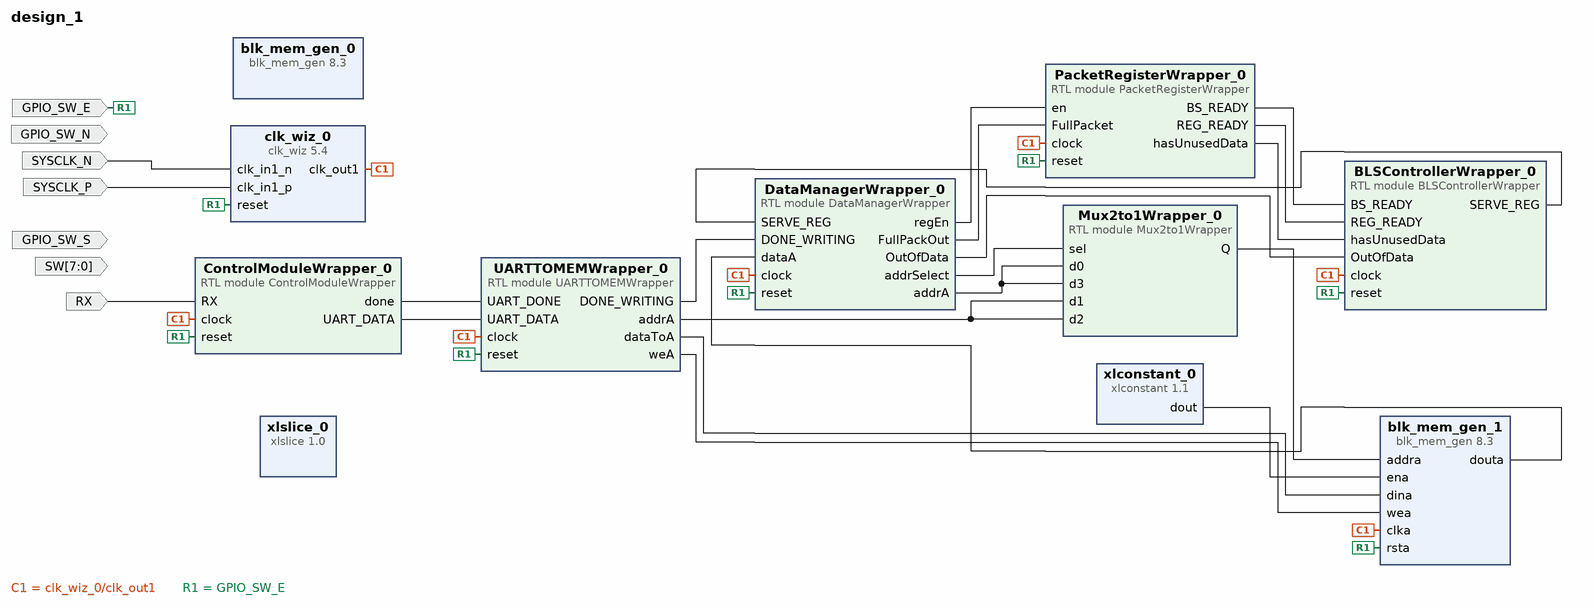
[diagram p0: block diagram of the top level]
# Vivado block design design_1, xc7vx485tffg1761-2, Vivado 2017.2
create_bd_design design_1

create_bd_port -dir I -type clk SYSCLK_N
create_bd_port -dir I -type clk SYSCLK_P
create_bd_port -dir I GPIO_SW_S
create_bd_port -dir I -type rst GPIO_SW_E
set_property -dict {CONFIG.POLARITY ACTIVE_HIGH} [get_bd_ports GPIO_SW_E]
create_bd_port -dir I GPIO_SW_N
create_bd_port -dir I -from 7 -to 0 SW
create_bd_port -dir I RX

create_bd_cell -type ip -vlnv xilinx.com:ip:clk_wiz:5.4 clk_wiz_0
set_property -dict [list \
  CONFIG.CLKIN1_JITTER_PS 50.0 \
  CONFIG.CLKOUT1_REQUESTED_OUT_FREQ 100 \
  CONFIG.PRIM_SOURCE Differential_clock_capable_pin \
  CONFIG.MMCM_DIVCLK_DIVIDE 1 \
  CONFIG.MMCM_CLKFBOUT_MULT_F 5.000 \
  CONFIG.MMCM_CLKIN1_PERIOD 5.000 \
  CONFIG.MMCM_CLKIN2_PERIOD 10.0 \
  CONFIG.MMCM_CLKOUT0_DIVIDE_F 10.000 \
  CONFIG.USE_BOARD_FLOW true \
  CONFIG.CLK_IN1_BOARD_INTERFACE sys_diff_clock \
  CONFIG.RESET_BOARD_INTERFACE Custom \
  CONFIG.CLKOUT1_JITTER 112.316 \
  CONFIG.CLKOUT1_PHASE_ERROR 89.971 \
] [get_bd_cells clk_wiz_0]
create_bd_cell -type ip -vlnv xilinx.com:ip:xlslice:1.0 xlslice_0
set_property -dict {CONFIG.DIN_FROM 7 CONFIG.DOUT_WIDTH 8} [get_bd_cells xlslice_0]
create_bd_cell -type ip -vlnv xilinx.com:ip:blk_mem_gen:8.3 blk_mem_gen_0
set_property -dict [list \
  CONFIG.Memory_Type True_Dual_Port_RAM \
  CONFIG.Assume_Synchronous_Clk true \
  CONFIG.Enable_B Use_ENB_Pin \
  CONFIG.Use_RSTB_Pin true \
  CONFIG.Port_B_Clock 100 \
  CONFIG.Port_B_Write_Rate 50 \
  CONFIG.Port_B_Enable_Rate 100 \
] [get_bd_cells blk_mem_gen_0]
create_bd_cell -type module -reference ControlModuleWrapper ControlModuleWrapper_0
create_bd_cell -type ip -vlnv xilinx.com:ip:blk_mem_gen:8.3 blk_mem_gen_1
set_property -dict [list \
  CONFIG.Memory_Type True_Dual_Port_RAM \
  CONFIG.Assume_Synchronous_Clk true \
  CONFIG.Enable_B Use_ENB_Pin \
  CONFIG.Use_RSTB_Pin true \
  CONFIG.Port_B_Clock 100 \
  CONFIG.Port_B_Write_Rate 50 \
  CONFIG.Port_B_Enable_Rate 100 \
] [get_bd_cells blk_mem_gen_1]
create_bd_cell -type module -reference UARTTOMEMWrapper UARTTOMEMWrapper_0
create_bd_cell -type module -reference DataManagerWrapper DataManagerWrapper_0
create_bd_cell -type module -reference PacketRegisterWrapper PacketRegisterWrapper_0
create_bd_cell -type module -reference BLSControllerWrapper BLSControllerWrapper_0
create_bd_cell -type module -reference Mux2to1Wrapper Mux2to1Wrapper_0
set_property -dict {CONFIG.WIDTH 32} [get_bd_cells Mux2to1Wrapper_0]
create_bd_cell -type ip -vlnv xilinx.com:ip:xlconstant:1.1 xlconstant_0

# ---- connections ----

connect_bd_net -net clk_in1_n_1 [get_bd_ports SYSCLK_N] [get_bd_pins clk_wiz_0/clk_in1_n]
connect_bd_net -net clk_in1_p_1 [get_bd_ports SYSCLK_P] [get_bd_pins clk_wiz_0/clk_in1_p]
connect_bd_net [get_bd_pins clk_wiz_0/clk_out1] \
  [get_bd_pins ControlModuleWrapper_0/clock] [get_bd_pins blk_mem_gen_1/clka] [get_bd_pins UARTTOMEMWrapper_0/clock] \
  [get_bd_pins DataManagerWrapper_0/clock] [get_bd_pins PacketRegisterWrapper_0/clock] \
  [get_bd_pins BLSControllerWrapper_0/clock]
connect_bd_net -net reset_rtl_1 [get_bd_ports GPIO_SW_E] \
  [get_bd_pins clk_wiz_0/reset] [get_bd_pins ControlModuleWrapper_0/reset] [get_bd_pins UARTTOMEMWrapper_0/reset] \
  [get_bd_pins DataManagerWrapper_0/reset] [get_bd_pins PacketRegisterWrapper_0/reset] \
  [get_bd_pins BLSControllerWrapper_0/reset] [get_bd_pins blk_mem_gen_1/rsta]
# net SW_1 has one end: SW
connect_bd_net [get_bd_ports RX] [get_bd_pins ControlModuleWrapper_0/RX]
connect_bd_net [get_bd_pins ControlModuleWrapper_0/done] [get_bd_pins UARTTOMEMWrapper_0/UART_DONE]
connect_bd_net [get_bd_pins ControlModuleWrapper_0/UART_DATA] [get_bd_pins UARTTOMEMWrapper_0/UART_DATA]
connect_bd_net [get_bd_pins DataManagerWrapper_0/regEn] [get_bd_pins PacketRegisterWrapper_0/en]
connect_bd_net [get_bd_pins DataManagerWrapper_0/FullPackOut] [get_bd_pins PacketRegisterWrapper_0/FullPacket]
connect_bd_net -net BlkSchlsEqEuroNoDiv_0_ap_ready [get_bd_pins PacketRegisterWrapper_0/BS_READY] [get_bd_pins BLSControllerWrapper_0/BS_READY]
connect_bd_net [get_bd_pins PacketRegisterWrapper_0/REG_READY] [get_bd_pins BLSControllerWrapper_0/REG_READY]
connect_bd_net [get_bd_pins PacketRegisterWrapper_0/hasUnusedData] [get_bd_pins BLSControllerWrapper_0/hasUnusedData]
connect_bd_net [get_bd_pins DataManagerWrapper_0/OutOfData] [get_bd_pins BLSControllerWrapper_0/OutOfData]
connect_bd_net [get_bd_pins BLSControllerWrapper_0/SERVE_REG] [get_bd_pins DataManagerWrapper_0/SERVE_REG]
connect_bd_net [get_bd_pins Mux2to1Wrapper_0/Q] [get_bd_pins blk_mem_gen_1/addra]
connect_bd_net [get_bd_pins UARTTOMEMWrapper_0/addrA] [get_bd_pins Mux2to1Wrapper_0/d1] [get_bd_pins Mux2to1Wrapper_0/d2]
connect_bd_net [get_bd_pins DataManagerWrapper_0/addrSelect] [get_bd_pins Mux2to1Wrapper_0/sel]
connect_bd_net [get_bd_pins DataManagerWrapper_0/addrA] [get_bd_pins Mux2to1Wrapper_0/d0] [get_bd_pins Mux2to1Wrapper_0/d3]
connect_bd_net [get_bd_pins UARTTOMEMWrapper_0/dataToA] [get_bd_pins blk_mem_gen_1/dina]
connect_bd_net [get_bd_pins UARTTOMEMWrapper_0/DONE_WRITING] [get_bd_pins DataManagerWrapper_0/DONE_WRITING]
connect_bd_net [get_bd_pins UARTTOMEMWrapper_0/weA] [get_bd_pins blk_mem_gen_1/wea]
connect_bd_net [get_bd_pins xlconstant_0/dout] [get_bd_pins blk_mem_gen_1/ena]
connect_bd_net [get_bd_pins blk_mem_gen_1/douta] [get_bd_pins DataManagerWrapper_0/dataA]

validate_bd_design
save_bd_design
